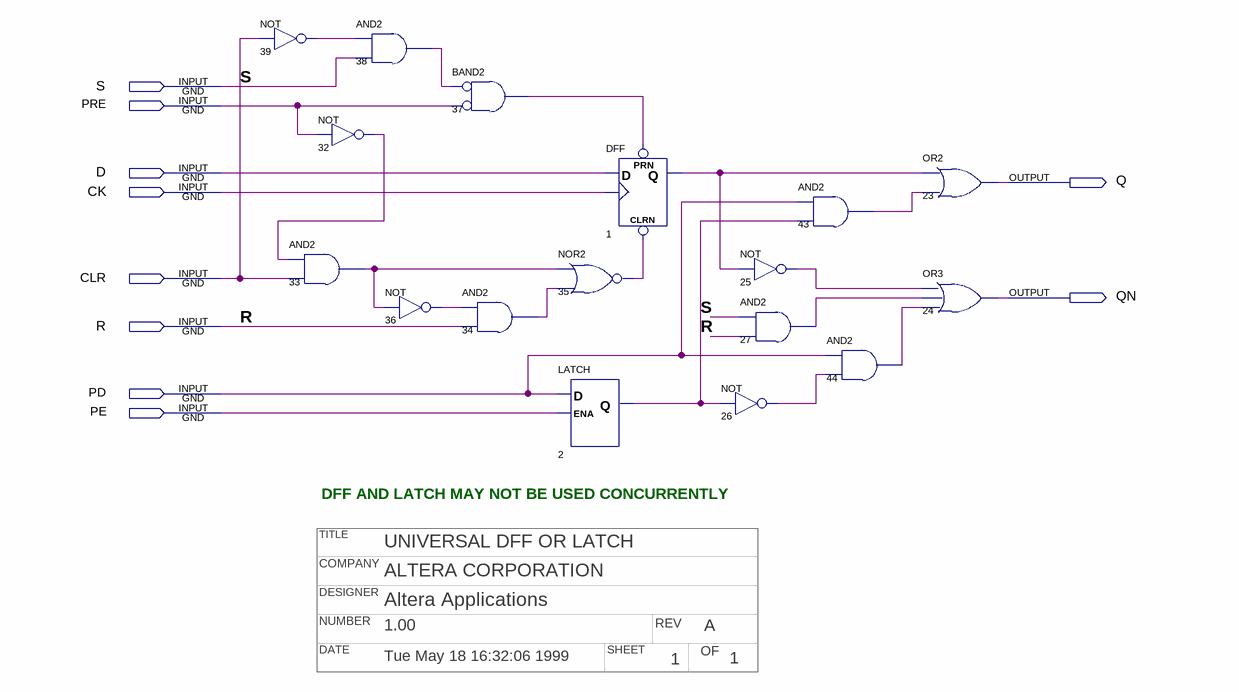
[diagram p0: schematic sheet]
// Quartus schematic udfdl.bdf as structural Verilog: 17 symbols, 10 pins
// Title block: TITLE: UNIVERSAL DFF OR LATCH; COMPANY: ALTERA CORPORATION; DESIGNER: Altera Applications; NUMBER: 1.00; REV: A; DATE: Tue May 18 16:32:06 1999; SHEET: 1; OF: 1
module udfdl (
  input  S,
  input  PRE,
  input  D,
  input  CK,
  input  CLR,
  input  R,
  input  PD,
  input  PE,
  output Q,
  output QN
);

  wire n1_q, n2_q, n25_out, n26_out, n27_out, n32_out, n33_out, n34_out, n35_out, n36_out, n37_out, n38_out,
       n39_out, n43_out, n44_out;

  not u_39 (n39_out, CLR);
  and u_38 (n38_out, n39_out, S);
  not u_32 (n32_out, PRE);
  and u_33 (n33_out, n32_out, CLR);
  not u_36 (n36_out, n33_out);
  and u_37 (n37_out, ~n38_out, ~PRE);  // BAND2
  and u_34 (n34_out, n36_out, R);
  nor u_35 (n35_out, n33_out, n34_out);
  LATCH u_2 (.D(PD), .ENA(PE), .Q(n2_q));
  DFF u_1 (.CLRN(n35_out), .CLK(CK), .D(D), .PRN(n37_out), .Q(n1_q));
  not u_25 (n25_out, n1_q);
  and u_27 (n27_out, S, R);
  not u_26 (n26_out, n2_q);
  and u_43 (n43_out, PD, n2_q);
  and u_44 (n44_out, PD, n26_out);
  or u_23 (Q, n1_q, n43_out);
  or u_24 (QN, n25_out, n27_out, n44_out);

  // Notes on the sheet:
  //   DFF AND LATCH MAY NOT BE USED CONCURRENTLY
endmodule
